# EAGLE design 555-blinker (EAGLE 9.6.2)
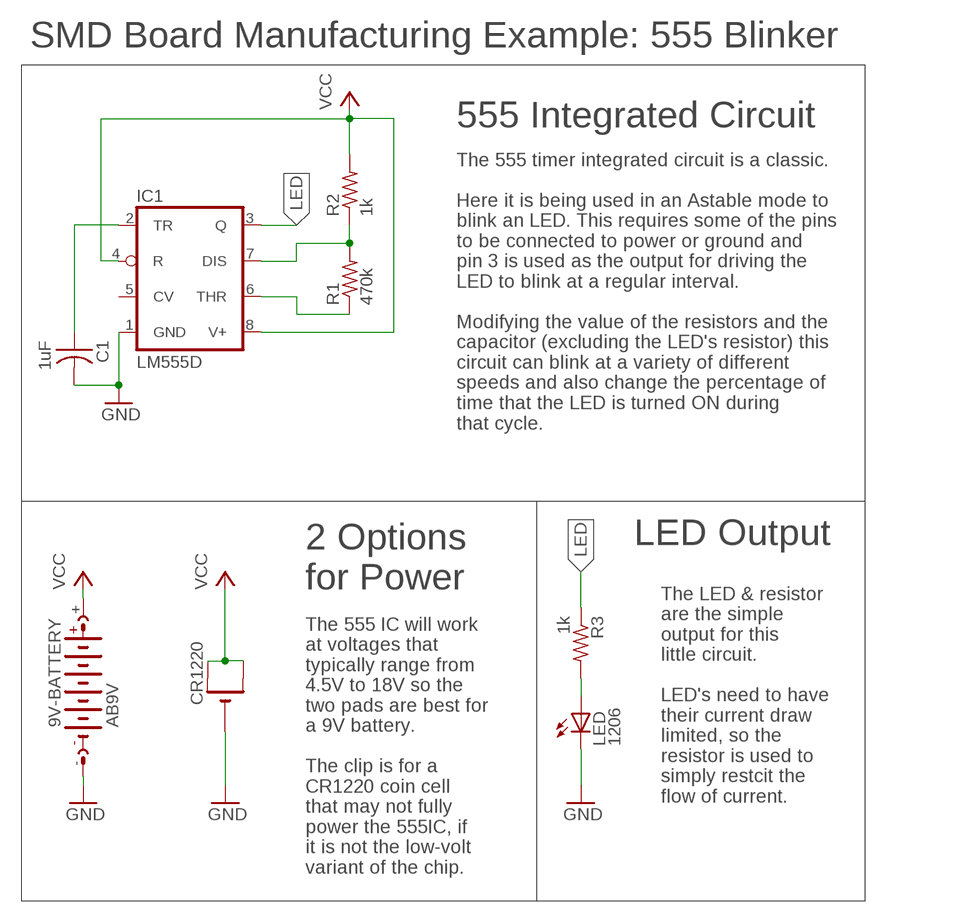
[diagram p0: schematic, sheet 1]

## Parts
9V-BATTERY  AB9V  [AB9V]
C1  1uF  CAP-US1206FAB  [C1206FAB]
CR1220  CR1220SMT  [CR1220-SMD]
IC1  LM555D  [SO08]
LED  1206  LEDFAB1206  [LED1206FAB]
R1  470k  RES-US1206FAB  [R1206FAB]
R2  1k  RES-US1206FAB  [R1206FAB]
R3  1k  RES-US1206FAB  [R1206FAB]

## Nets
GND: 9V-BATTERY.- C1.2 CR1220.- IC1.1(GND) LED.2(C)
LED: IC1.3(Q) R3.1
N$1: IC1.7(DIS) R1.2 R2.1
N$2: IC1.6(THR) R1.1
N$5: C1.1 IC1.2(TR)
N$6: LED.1(A) R3.2
VCC: 9V-BATTERY.+ CR1220.+$1(+) CR1220.+$2(+1) IC1.4(R) IC1.8(V+) R2.2
Unconnected: IC1.5(CV)

## Notes on the sheet
- SMD Board Manufacturing Example: 555 Blinker
- 555 Integrated Circuit
- The 555 timer integrated circuit is a classic.
  
  Here it is being used in an Astable mode to
  blink an LED. This requires some of the pins
  to be connected to power or ground and 
  pin 3 is used as the output for driving the 
  LED to blink at a regular interval. 
  
  Modifying the value of the resistors and the
  capacitor (excluding the LED's resistor) this
  circuit can blink at a variety of different
  speeds and also change the percentage of 
  time that the LED is turned ON during
  that cycle.
- LED Output
- 2 Options
  for Power
- The LED & resistor
  are the simple 
  output for this 
  little circuit. 
  
  LED's need to have
  their current draw 
  limited, so the
  resistor is used to
  simply restcit the 
  flow of current.
- The 555 IC will work
  at voltages that 
  typically range from 
  4.5V to 18V so the 
  two pads are best for
  a 9V battery. 
  
  The clip is for a 
  CR1220 coin cell 
  that may not fully
  power the 555IC, if
  it is not the low-volt
  variant of the chip.

## Library data of the parts
9V-BATTERY = battery:AB9V: 9-V BATTERY CLIP
C1 = fab:CAP-US
CR1220 = adafruit:CR1220: CR1216/CR1220/CR1225 12mm 3V lithium coin cell Great for battery packup. Both SMT and THM holders. Note the THM package has the ground pads on both sides of the PCB so that the masks are the same - this reduces the cost
IC1 = adafruit:*555: TIMER Changed DIP package to have round (not oval) pin pads http://www.ladyada.net/library/pcb/eaglelibrary.html
LED = fab:LED: LED
R1-R3 = fab:RES-US: Resistor (US Symbol) Variants with postfix FAB are widened to allow the routing of internal traces

## Board
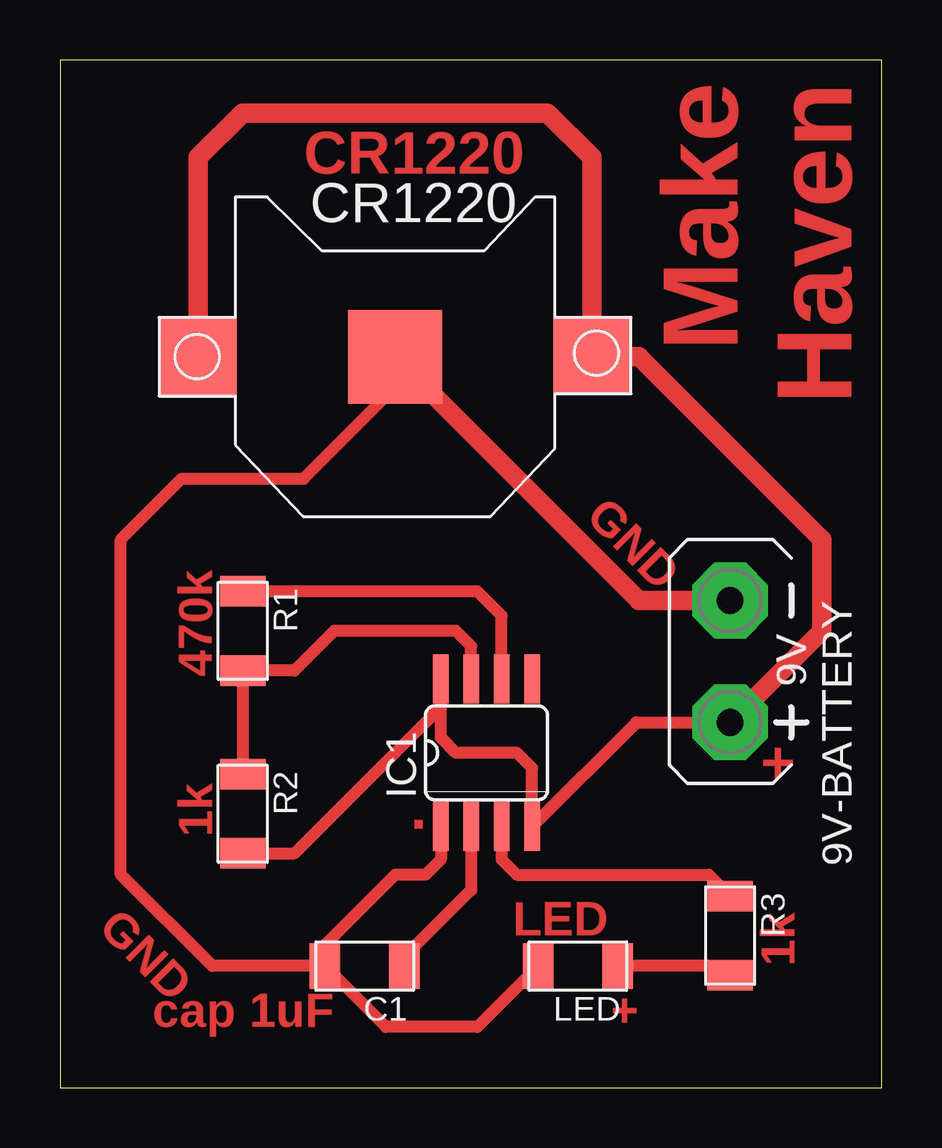
[diagram p1: board, top side]

Size 34.27 x 42.85 mm. Coordinates in mm from the lower left corner, seen from the top.
Outline: 0,0 34.27,0 34.27,42.85 0,42.85 0,0
Copper layers (1*16): Top 0.035mm / dielectric 1.5mm / Bottom 0.035mm
Design rules "default": minimum track width 6mil, minimum drill 0.35mm, track to track 6mil, track to pad 6mil, pad to pad 6mil, via to via 6mil, smd to smd 6mil, copper to edge 40mil, drill to drill 6mil, minimum pad ring 10mil, minimum via ring 8mil, stop-mask expansion 4mil, vias tented up to drill 0mil, thermal gap 10mil

### Footprints (pad centres in the part's own frame; a part is rotated, then mirrored left to right if it is on the bottom)
AB9V = drill 1.118 pad 3.15 octagon: + 0,2.54; - 0,-2.54
C1206FAB = smd 1.27 x 1.905: 1 -1.651,0; 2 1.651,0
CR1220-SMD = smd 3.2 x 3.2: +$1 -8.2,0; +$2 8.2,0 | smd 3.9 x 3.9: - 0,0
SO08 = smd 0.66 x 2.032: 1 -1.905,-3.073; 2 -0.635,-3.073; 3 0.635,-3.073; 4 1.905,-3.073; 5 1.905,3.073; 6 0.635,3.073; 7 -0.635,3.073; 8 -1.905,3.073
LED1206FAB = smd 1.27 x 1.905: 1 -1.651,0; 2 1.651,0
R1206FAB = smd 1.27 x 1.905: 1 -1.651,0; 2 1.651,0

### Placement (x,y rotation side)
9V-BATTERY  27.94,17.78 180 top
C1  12.7,5.08 180 top
CR1220  13.97,30.48 0 top
IC1  17.78,13.97 0 top
LED  21.59,5.08 180 top
R1  7.62,19.05 270 top
R2  7.62,11.43 270 top
R3  27.94,6.35 270 top

### Tracks (layer width: path | path; a pad name or v marks a point on that pad's centre or on a via)
GND
  Top 0.508: 15.88,10.79 IC1.1 15.88,9.53 15.24,8.89 13.97,8.89 11.05,5.97 C1.2 | LED.2 17.4,2.54 13.59,2.54 C1.2 | C1.2 6.35,5.08 2.54,8.89 2.54,22.86 5.08,25.4 10.16,25.4 13.97,29.21 CR1220.-
  Top 0.813: CR1220.- 24.13,20.32 9V-BATTERY.-
LED
  Top 0.508: IC1.3 18.41,9.53 19.05,8.89 27.05,8.89 R3.1
N$1
  Top 0.508: IC1.7 17.14,18.41 16.51,19.05 11.43,19.05 9.78,17.4 R1.2 R2.1
N$2
  Top 0.508: IC1.6 18.41,19.68 17.4,20.7 R1.1
N$5
  Top 0.508: IC1.2 17.14,8.26 14.35,5.46 C1.1
N$6
  Top 0.508: 23.24,4.7 LED.1 27.56,5.08 R3.2
VCC
  Top 0.508: 9V-BATTERY.+ 24.03,15.24 IC1.4 19.68,13.34 19.05,13.97 16.51,13.97 15.88,14.61 15.88,15.88 | R2.2 9.78,9.78 15.88,15.88 | 15.88,15.88 IC1.8
  Top 0.813: 9V-BATTERY.+ 31.75,19.05 31.75,22.86 24.13,30.48 CR1220.+$2 22.17,38.79 20.32,40.64 7.62,40.64 5.77,38.79 CR1220.+$1

### Text on the board
Top: Make / Haven | CR1220 | GND | 470k | 1k | + | . | GND | LED | 1k | cap 1uF | +